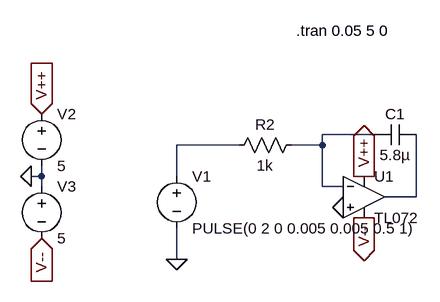
[diagram p0: schematic InversorIntegrator.asc]
InversorIntegrator.asc, the LTspice schematic file:
Version 4
SHEET 1 880 680
WIRE 224 208 144 208
WIRE 16 224 -80 224
WIRE 144 224 144 208
WIRE 144 224 96 224
WIRE -288 272 -288 256
WIRE -288 272 -304 272
WIRE -80 272 -80 224
WIRE -288 288 -288 272
WIRE 144 288 144 224
WIRE 176 288 144 288
WIRE 288 304 288 208
WIRE 288 304 240 304
WIRE -80 400 -80 352
FLAG -304 272 0
FLAG -80 400 0
FLAG -288 176 V++
IOPIN -288 176 In
FLAG -288 368 V--
IOPIN -288 368 In
FLAG 208 336 V--
IOPIN 208 336 Out
FLAG 208 272 V++
IOPIN 208 272 Out
FLAG 176 320 0
SYMBOL OpAmps/TL072 208 240 R0
SYMATTR InstName U1
SYMBOL Voltage -80 256 R0
SYMATTR InstName V1
SYMATTR Value PULSE(0 2 0 0.005 0.005 0.5 1)
SYMBOL Res 112 208 R90
WINDOW 0 0 56 VBottom 2
WINDOW 3 32 56 VTop 2
SYMATTR InstName R2
SYMATTR Value 1k
SYMBOL Cap 288 192 R90
WINDOW 0 0 32 VBottom 2
WINDOW 3 32 32 VTop 2
SYMATTR InstName C1
SYMATTR Value 5.8µ
SYMBOL Voltage -288 160 R0
SYMATTR InstName V2
SYMATTR Value 5
SYMBOL Voltage -288 272 R0
SYMATTR InstName V3
SYMATTR Value 5
TEXT 104 48 Left 2 !.tran 0.05 5 0

The netlist it stands for:
* InversorIntegrator.asc
XU1 0 N001 V++ V-- N003 TL072  ; pins In+ In- V+ V- OUT
V1 N002 0 PULSE(0 2 0 0.005 0.005 0.5 1)
R2 N001 N002 1k
C1 N003 N001 5.8µ
V2 V++ 0 5
V3 0 V-- 5
.tran 0.05 5 0
.backanno
.end